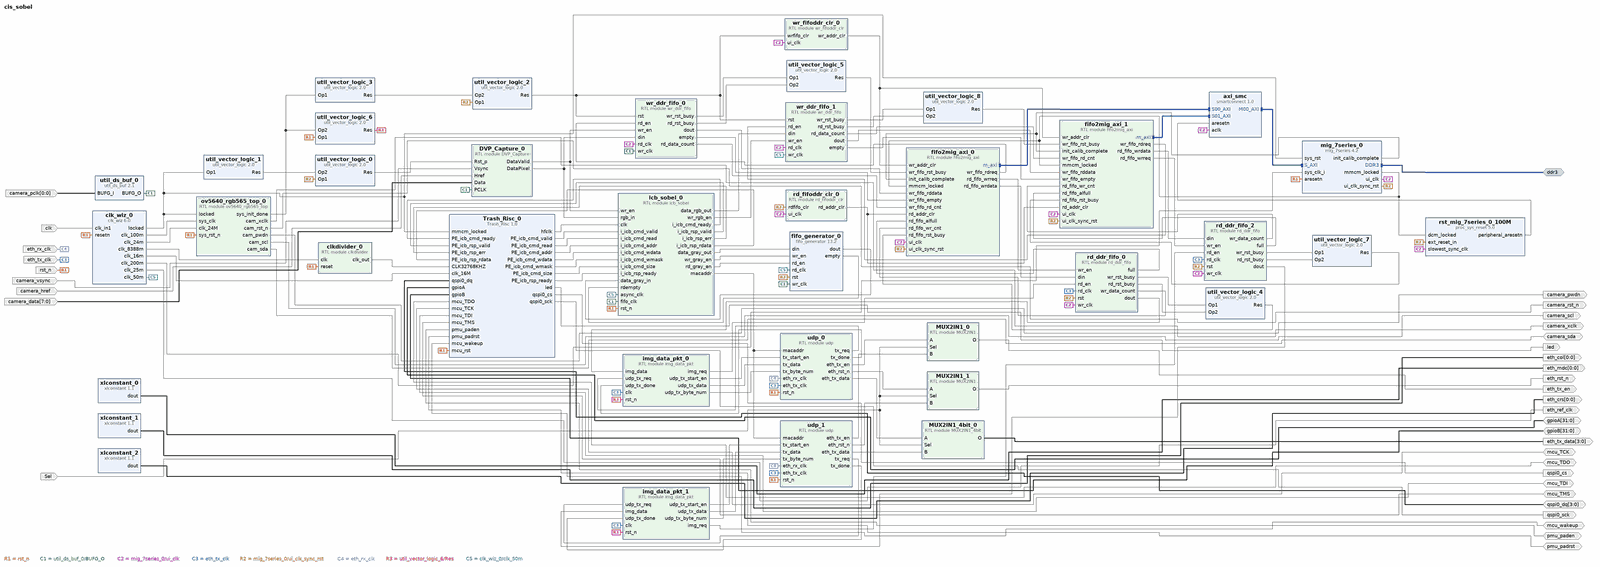
[diagram p0: block diagram of the top level, whole]
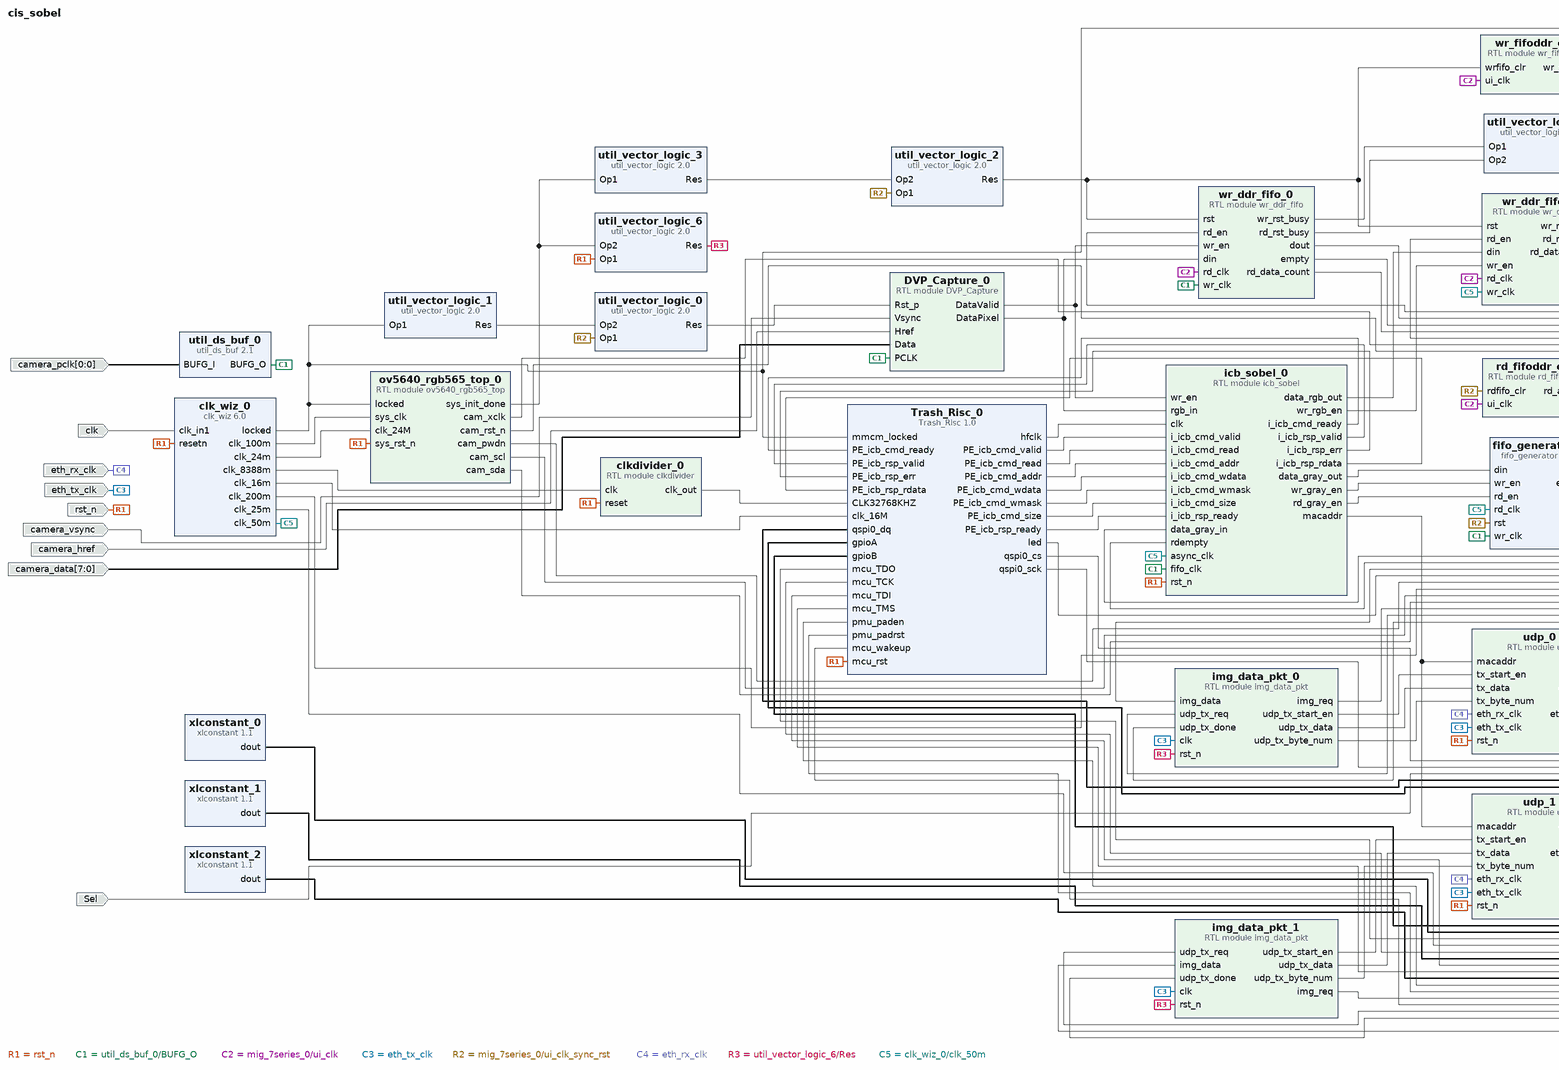
[diagram p1: block diagram of the top level, left part]
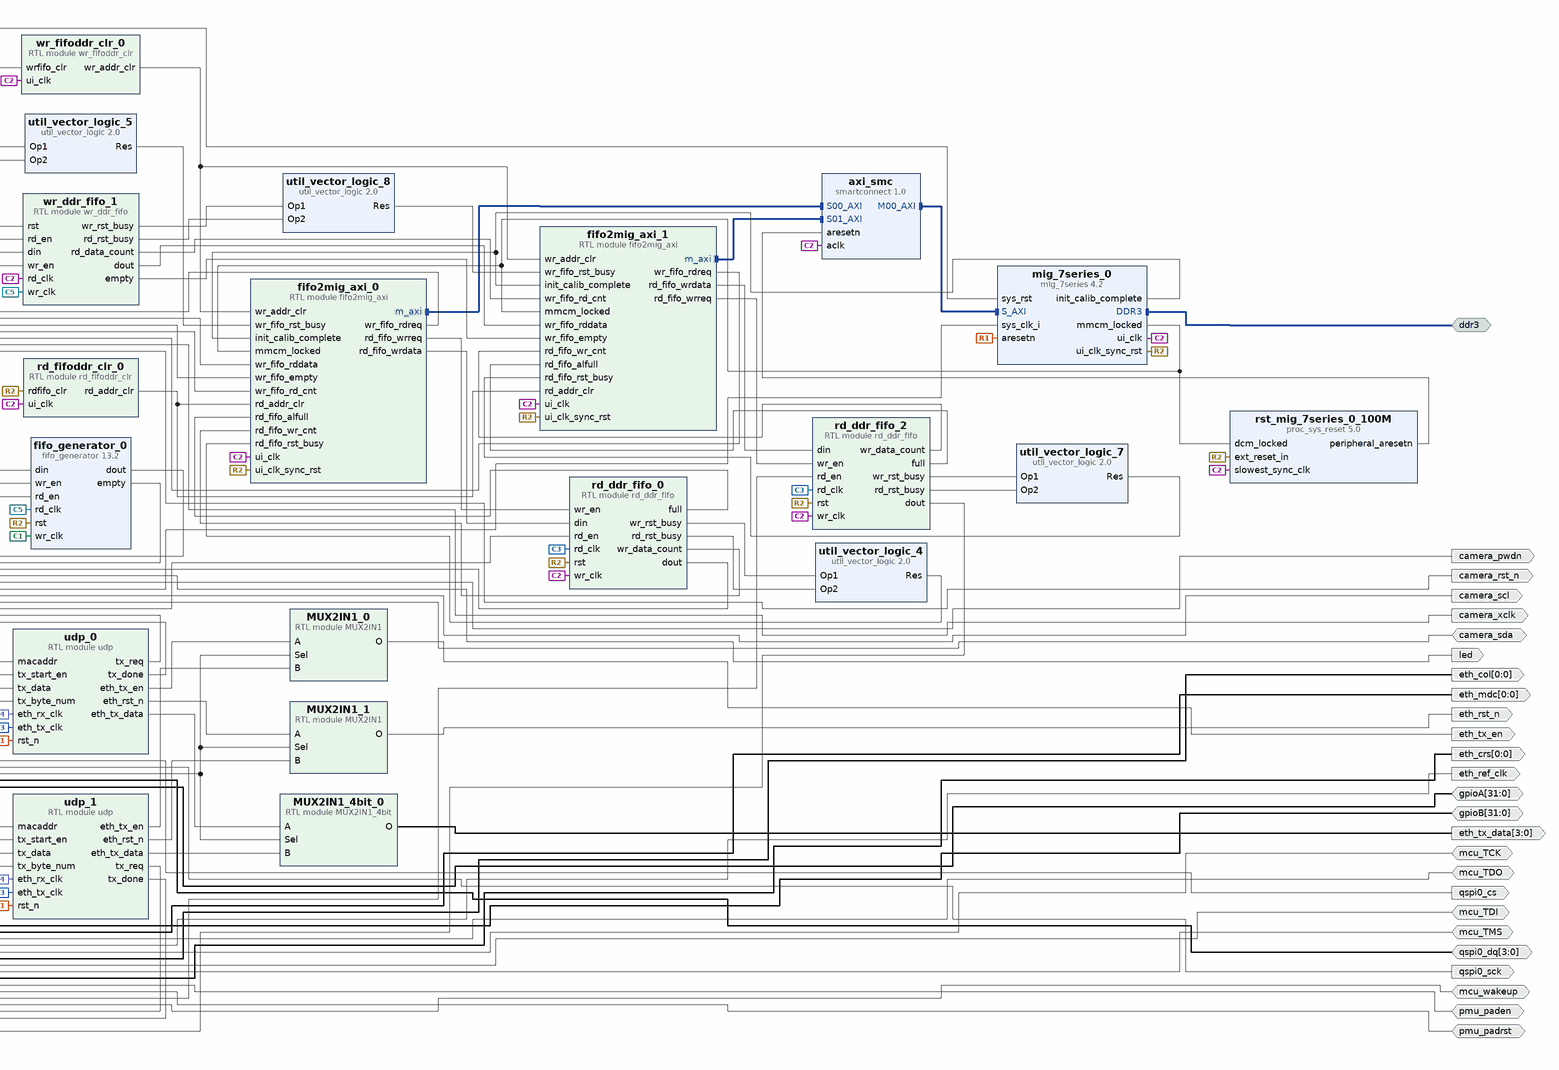
[diagram p2: block diagram of the top level, right part]
# Vivado block design cis_sobel, xc7a100tcsg324-1, Vivado 2019.1
create_bd_design cis_sobel

create_bd_intf_port -mode Master -vlnv xilinx.com:interface:ddrx_rtl:1.0 ddr3
create_bd_port -dir I -type rst rst_n
create_bd_port -dir O camera_xclk
create_bd_port -dir O -type rst camera_rst_n
create_bd_port -dir O camera_pwdn
create_bd_port -dir O camera_scl
create_bd_port -dir IO camera_sda
create_bd_port -dir I camera_vsync
create_bd_port -dir I camera_href
create_bd_port -dir I -from 7 -to 0 camera_data
create_bd_port -dir I -from 0 -to 0 -type clk camera_pclk
set_property -dict {CONFIG.FREQ_HZ 100000000} [get_bd_ports camera_pclk]
create_bd_port -dir I -type clk eth_tx_clk
set_property -dict {CONFIG.FREQ_HZ 100000000} [get_bd_ports eth_tx_clk]
create_bd_port -dir I -type clk clk
set_property -dict {CONFIG.FREQ_HZ 100000000} [get_bd_ports clk]
create_bd_port -dir I -type clk eth_rx_clk
set_property -dict {CONFIG.FREQ_HZ 100000000} [get_bd_ports eth_rx_clk]
create_bd_port -dir O -from 0 -to 0 eth_mdc
create_bd_port -dir O -from 0 -to 0 eth_col
create_bd_port -dir O -from 0 -to 0 eth_crs
create_bd_port -dir O -type clk eth_ref_clk
create_bd_port -dir O led
create_bd_port -dir O qspi0_cs
create_bd_port -dir O qspi0_sck
create_bd_port -dir IO -from 3 -to 0 qspi0_dq
create_bd_port -dir IO -from 31 -to 0 gpioA
create_bd_port -dir IO -from 31 -to 0 gpioB
create_bd_port -dir IO mcu_TDO
create_bd_port -dir IO mcu_TCK
create_bd_port -dir IO mcu_TDI
create_bd_port -dir IO mcu_TMS
create_bd_port -dir IO pmu_paden
create_bd_port -dir IO pmu_padrst
create_bd_port -dir IO mcu_wakeup
create_bd_port -dir O -from 3 -to 0 eth_tx_data
create_bd_port -dir I Sel
create_bd_port -dir O eth_tx_en
create_bd_port -dir O eth_rst_n

create_bd_cell -type module -reference fifo2mig_axi fifo2mig_axi_0
set_property -dict [list \
  CONFIG.AXI_ID {"0001"} \
  CONFIG.AXI_LEN {"00011111"} \
  CONFIG.RD_DDR_ADDR_BEGIN 614400 \
  CONFIG.RD_DDR_ADDR_END 1228800 \
  CONFIG.WR_DDR_ADDR_BEGIN 614400 \
  CONFIG.WR_DDR_ADDR_END 1228800 \
] [get_bd_cells fifo2mig_axi_0]
create_bd_cell -type module -reference img_data_pkt img_data_pkt_0
set_property -dict {CONFIG.CMOS_H_PIXEL {"01010000000"} CONFIG.CMOS_V_PIXEL {"00111100000"}} [get_bd_cells img_data_pkt_0]
create_bd_cell -type module -reference ov5640_rgb565_top ov5640_rgb565_top_0
create_bd_cell -type module -reference wr_ddr_fifo wr_ddr_fifo_0
create_bd_cell -type module -reference rd_ddr_fifo rd_ddr_fifo_0
create_bd_cell -type ip -vlnv xilinx.com:ip:mig_7series:4.2 mig_7series_0
set_property -dict [list \
  CONFIG.BOARD_MIG_PARAM Custom \
  CONFIG.MIG_DONT_TOUCH_PARAM Custom \
  CONFIG.RESET_BOARD_INTERFACE Custom \
  CONFIG.XML_INPUT_FILE mig_a.prj \
] [get_bd_cells mig_7series_0]
create_bd_cell -type ip -vlnv xilinx.com:ip:clk_wiz:6.0 clk_wiz_0
set_property -dict [list \
  CONFIG.CLKOUT1_JITTER 130.958 \
  CONFIG.CLKOUT1_PHASE_ERROR 98.575 \
  CONFIG.CLKOUT2_JITTER 175.402 \
  CONFIG.CLKOUT2_PHASE_ERROR 98.575 \
  CONFIG.CLKOUT2_REQUESTED_OUT_FREQ 25.000 \
  CONFIG.CLKOUT2_USED true \
  CONFIG.CLKOUT3_JITTER 177.091 \
  CONFIG.CLKOUT3_PHASE_ERROR 98.575 \
  CONFIG.CLKOUT3_REQUESTED_OUT_FREQ 24.000 \
  CONFIG.CLKOUT3_USED true \
  CONFIG.CLKOUT4_JITTER 114.829 \
  CONFIG.CLKOUT4_PHASE_ERROR 98.575 \
  CONFIG.CLKOUT4_REQUESTED_OUT_FREQ 200.000 \
  CONFIG.CLKOUT4_USED true \
  CONFIG.CLKOUT5_JITTER 191.683 \
  CONFIG.CLKOUT5_PHASE_ERROR 98.575 \
  CONFIG.CLKOUT5_REQUESTED_OUT_FREQ 16.000 \
  CONFIG.CLKOUT5_USED true \
  CONFIG.CLKOUT6_JITTER 216.703 \
  CONFIG.CLKOUT6_PHASE_ERROR 98.575 \
  CONFIG.CLKOUT6_REQUESTED_OUT_FREQ 8.388 \
  CONFIG.CLKOUT6_USED true \
  CONFIG.CLKOUT7_JITTER 151.636 \
  CONFIG.CLKOUT7_PHASE_ERROR 98.575 \
  CONFIG.CLKOUT7_REQUESTED_OUT_FREQ 50.000 \
  CONFIG.CLKOUT7_USED true \
  CONFIG.CLK_OUT1_PORT clk_100m \
  CONFIG.CLK_OUT2_PORT clk_25m \
  CONFIG.CLK_OUT3_PORT clk_24m \
  CONFIG.CLK_OUT4_PORT clk_200m \
  CONFIG.CLK_OUT5_PORT clk_16m \
  CONFIG.CLK_OUT6_PORT clk_8388m \
  CONFIG.CLK_OUT7_PORT clk_50m \
  CONFIG.MMCM_CLKFBOUT_MULT_F 10.000 \
  CONFIG.MMCM_CLKIN1_PERIOD 10.000 \
  CONFIG.MMCM_CLKIN2_PERIOD 10.000 \
  CONFIG.MMCM_CLKOUT0_DIVIDE_F 10.000 \
  CONFIG.MMCM_CLKOUT1_DIVIDE 40 \
  CONFIG.MMCM_CLKOUT2_DIVIDE 42 \
  CONFIG.MMCM_CLKOUT3_DIVIDE 5 \
  CONFIG.MMCM_CLKOUT4_DIVIDE 63 \
  CONFIG.MMCM_CLKOUT5_DIVIDE 119 \
  CONFIG.MMCM_CLKOUT6_DIVIDE 20 \
  CONFIG.NUM_OUT_CLKS 7 \
  CONFIG.RESET_PORT resetn \
  CONFIG.RESET_TYPE ACTIVE_LOW \
] [get_bd_cells clk_wiz_0]
create_bd_cell -type ip -vlnv xilinx.com:ip:util_ds_buf:2.1 util_ds_buf_0
set_property -dict {CONFIG.C_BUF_TYPE BUFG} [get_bd_cells util_ds_buf_0]
create_bd_cell -type module -reference DVP_Capture DVP_Capture_0
create_bd_cell -type ip -vlnv xilinx.com:ip:util_vector_logic:2.0 util_vector_logic_0
set_property -dict {CONFIG.C_OPERATION or CONFIG.C_SIZE 1} [get_bd_cells util_vector_logic_0]
create_bd_cell -type ip -vlnv xilinx.com:ip:util_vector_logic:2.0 util_vector_logic_1
set_property -dict {CONFIG.C_OPERATION not CONFIG.C_SIZE 1} [get_bd_cells util_vector_logic_1]
create_bd_cell -type ip -vlnv xilinx.com:ip:util_vector_logic:2.0 util_vector_logic_2
set_property -dict {CONFIG.C_OPERATION or CONFIG.C_SIZE 1} [get_bd_cells util_vector_logic_2]
create_bd_cell -type ip -vlnv xilinx.com:ip:util_vector_logic:2.0 util_vector_logic_3
set_property -dict {CONFIG.C_OPERATION not CONFIG.C_SIZE 1} [get_bd_cells util_vector_logic_3]
create_bd_cell -type ip -vlnv xilinx.com:ip:util_vector_logic:2.0 util_vector_logic_4
set_property -dict {CONFIG.C_OPERATION or CONFIG.C_SIZE 1} [get_bd_cells util_vector_logic_4]
create_bd_cell -type ip -vlnv xilinx.com:ip:util_vector_logic:2.0 util_vector_logic_5
set_property -dict {CONFIG.C_OPERATION or CONFIG.C_SIZE 1} [get_bd_cells util_vector_logic_5]
create_bd_cell -type ip -vlnv xilinx.com:ip:util_vector_logic:2.0 util_vector_logic_6
set_property -dict {CONFIG.C_OPERATION and CONFIG.C_SIZE 1} [get_bd_cells util_vector_logic_6]
create_bd_cell -type module -reference wr_fifoddr_clr wr_fifoddr_clr_0
create_bd_cell -type module -reference rd_fifoddr_clr rd_fifoddr_clr_0
create_bd_cell -type ip -vlnv xilinx.com:ip:xlconstant:1.1 xlconstant_0
create_bd_cell -type ip -vlnv xilinx.com:ip:xlconstant:1.1 xlconstant_1
create_bd_cell -type ip -vlnv xilinx.com:ip:xlconstant:1.1 xlconstant_2
set_property -dict {CONFIG.CONST_VAL 0} [get_bd_cells xlconstant_2]
create_bd_cell -type ip -vlnv xilinx.com:ip:smartconnect:1.0 axi_smc
set_property -dict {CONFIG.NUM_SI 2} [get_bd_cells axi_smc]
create_bd_cell -type ip -vlnv xilinx.com:ip:proc_sys_reset:5.0 rst_mig_7series_0_100M
create_bd_cell -type module -reference fifo2mig_axi fifo2mig_axi_1
set_property -dict [list \
  CONFIG.AXI_ID {"0000"} \
  CONFIG.AXI_LEN {"00011111"} \
  CONFIG.RD_DDR_ADDR_BEGIN 0 \
  CONFIG.RD_DDR_ADDR_END 614400 \
  CONFIG.WR_DDR_ADDR_BEGIN 0 \
  CONFIG.WR_DDR_ADDR_END 614400 \
] [get_bd_cells fifo2mig_axi_1]
create_bd_cell -type module -reference clkdivider clkdivider_0
create_bd_cell -type module -reference wr_ddr_fifo wr_ddr_fifo_1
create_bd_cell -type module -reference rd_ddr_fifo rd_ddr_fifo_2
create_bd_cell -type ip -vlnv xilinx.com:ip:util_vector_logic:2.0 util_vector_logic_7
set_property -dict {CONFIG.C_OPERATION or CONFIG.C_SIZE 1} [get_bd_cells util_vector_logic_7]
create_bd_cell -type ip -vlnv xilinx.com:ip:util_vector_logic:2.0 util_vector_logic_8
set_property -dict {CONFIG.C_OPERATION or CONFIG.C_SIZE 1} [get_bd_cells util_vector_logic_8]
create_bd_cell -type module -reference img_data_pkt img_data_pkt_1
set_property -dict {CONFIG.CMOS_H_PIXEL {"01010000000"} CONFIG.CMOS_V_PIXEL {"00111100000"}} [get_bd_cells img_data_pkt_1]
create_bd_cell -type module -reference MUX2IN1 MUX2IN1_0
create_bd_cell -type module -reference MUX2IN1 MUX2IN1_1
create_bd_cell -type module -reference MUX2IN1_4bit MUX2IN1_4bit_0
create_bd_cell -type ip -vlnv xilinx.com:ip:fifo_generator:13.2 fifo_generator_0
set_property -dict [list \
  CONFIG.Enable_Safety_Circuit true \
  CONFIG.Fifo_Implementation Independent_Clocks_Block_RAM \
  CONFIG.Full_Flags_Reset_Value 1 \
  CONFIG.Input_Data_Width 8 \
  CONFIG.Output_Data_Width 8 \
] [get_bd_cells fifo_generator_0]
create_bd_cell -type ip -vlnv xilinx.com:user:Trash_Risc:1.0 Trash_Risc_0
create_bd_cell -type module -reference udp udp_0
set_property -dict {CONFIG.BOARD_IP 0xc0a80002 CONFIG.DES_IP 0xc0a80003 CONFIG.DES_MAC 0x70B5E849A3D2} [get_bd_cells udp_0]
create_bd_cell -type module -reference udp udp_1
set_property -dict {CONFIG.BOARD_IP 0xc0a80002 CONFIG.DES_IP 0xc0a80003 CONFIG.DES_MAC 0x70B5E849A3D2} [get_bd_cells udp_1]
create_bd_cell -type module -reference icb_sobel icb_sobel_0

# ---- connections ----

connect_bd_intf_net [get_bd_intf_pins fifo2mig_axi_0/m_axi] [get_bd_intf_pins axi_smc/S00_AXI]
connect_bd_intf_net [get_bd_intf_pins fifo2mig_axi_1/m_axi] [get_bd_intf_pins axi_smc/S01_AXI]
connect_bd_intf_net [get_bd_intf_pins axi_smc/M00_AXI] [get_bd_intf_pins mig_7series_0/S_AXI]
connect_bd_intf_net [get_bd_intf_ports ddr3] [get_bd_intf_pins mig_7series_0/DDR3]
connect_bd_net [get_bd_pins wr_ddr_fifo_0/dout] [get_bd_pins fifo2mig_axi_0/wr_fifo_rddata]
connect_bd_net [get_bd_pins clk_wiz_0/clk_100m] [get_bd_pins ov5640_rgb565_top_0/sys_clk]
connect_bd_net [get_bd_ports rst_n] \
  [get_bd_pins ov5640_rgb565_top_0/sys_rst_n] [get_bd_pins clk_wiz_0/resetn] [get_bd_pins mig_7series_0/aresetn] \
  [get_bd_pins util_vector_logic_6/Op1] [get_bd_pins clkdivider_0/reset] [get_bd_pins Trash_Risc_0/mcu_rst] \
  [get_bd_pins udp_0/rst_n] [get_bd_pins udp_1/rst_n] [get_bd_pins icb_sobel_0/rst_n]
connect_bd_net [get_bd_pins clk_wiz_0/clk_24m] [get_bd_pins ov5640_rgb565_top_0/clk_24M]
connect_bd_net [get_bd_pins clk_wiz_0/locked] \
  [get_bd_pins ov5640_rgb565_top_0/locked] [get_bd_pins mig_7series_0/sys_rst] [get_bd_pins util_vector_logic_1/Op1] \
  [get_bd_pins Trash_Risc_0/mmcm_locked]
connect_bd_net [get_bd_pins ov5640_rgb565_top_0/cam_xclk] [get_bd_ports camera_xclk]
connect_bd_net [get_bd_pins ov5640_rgb565_top_0/cam_rst_n] [get_bd_ports camera_rst_n]
connect_bd_net [get_bd_pins ov5640_rgb565_top_0/cam_pwdn] [get_bd_ports camera_pwdn]
connect_bd_net [get_bd_pins ov5640_rgb565_top_0/cam_scl] [get_bd_ports camera_scl]
connect_bd_net [get_bd_ports camera_sda] [get_bd_pins ov5640_rgb565_top_0/cam_sda]
connect_bd_net [get_bd_pins util_ds_buf_0/BUFG_O] \
  [get_bd_pins DVP_Capture_0/PCLK] [get_bd_pins wr_ddr_fifo_0/wr_clk] [get_bd_pins fifo_generator_0/wr_clk] \
  [get_bd_pins icb_sobel_0/fifo_clk]
connect_bd_net [get_bd_ports camera_vsync] [get_bd_pins DVP_Capture_0/Vsync]
connect_bd_net [get_bd_ports camera_href] [get_bd_pins DVP_Capture_0/Href]
connect_bd_net [get_bd_ports camera_data] [get_bd_pins DVP_Capture_0/Data]
connect_bd_net [get_bd_ports camera_pclk] [get_bd_pins util_ds_buf_0/BUFG_I]
connect_bd_net [get_bd_pins DVP_Capture_0/DataValid] [get_bd_pins wr_ddr_fifo_0/wr_en] [get_bd_pins icb_sobel_0/wr_en]
connect_bd_net [get_bd_pins DVP_Capture_0/DataPixel] [get_bd_pins wr_ddr_fifo_0/din] [get_bd_pins icb_sobel_0/rgb_in]
connect_bd_net [get_bd_pins mig_7series_0/ui_clk] \
  [get_bd_pins wr_ddr_fifo_0/rd_clk] [get_bd_pins rd_ddr_fifo_0/wr_clk] [get_bd_pins fifo2mig_axi_0/ui_clk] \
  [get_bd_pins wr_fifoddr_clr_0/ui_clk] [get_bd_pins rd_fifoddr_clr_0/ui_clk] [get_bd_pins axi_smc/aclk] \
  [get_bd_pins rst_mig_7series_0_100M/slowest_sync_clk] [get_bd_pins fifo2mig_axi_1/ui_clk] \
  [get_bd_pins wr_ddr_fifo_1/rd_clk] [get_bd_pins rd_ddr_fifo_2/wr_clk]
connect_bd_net [get_bd_pins fifo2mig_axi_0/wr_fifo_rdreq] [get_bd_pins wr_ddr_fifo_0/rd_en]
connect_bd_net [get_bd_pins wr_ddr_fifo_0/empty] [get_bd_pins fifo2mig_axi_0/wr_fifo_empty]
connect_bd_net [get_bd_pins wr_ddr_fifo_0/rd_data_count] [get_bd_pins fifo2mig_axi_0/wr_fifo_rd_cnt]
connect_bd_net [get_bd_pins fifo2mig_axi_0/rd_fifo_wrreq] [get_bd_pins rd_ddr_fifo_0/wr_en]
connect_bd_net [get_bd_pins fifo2mig_axi_0/rd_fifo_wrdata] [get_bd_pins rd_ddr_fifo_0/din]
connect_bd_net [get_bd_pins rd_ddr_fifo_0/full] [get_bd_pins fifo2mig_axi_0/rd_fifo_alfull]
connect_bd_net [get_bd_pins rd_ddr_fifo_0/wr_data_count] [get_bd_pins fifo2mig_axi_0/rd_fifo_wr_cnt]
connect_bd_net [get_bd_ports eth_tx_clk] \
  [get_bd_pins rd_ddr_fifo_0/rd_clk] [get_bd_pins img_data_pkt_0/clk] [get_bd_pins rd_ddr_fifo_2/rd_clk] \
  [get_bd_pins img_data_pkt_1/clk] [get_bd_pins udp_0/eth_tx_clk] [get_bd_pins udp_1/eth_tx_clk]
connect_bd_net [get_bd_pins img_data_pkt_0/img_req] [get_bd_pins rd_ddr_fifo_0/rd_en]
connect_bd_net [get_bd_pins rd_ddr_fifo_0/dout] [get_bd_pins img_data_pkt_0/img_data]
connect_bd_net [get_bd_ports clk] [get_bd_pins clk_wiz_0/clk_in1]
connect_bd_net [get_bd_pins mig_7series_0/ui_clk_sync_rst] \
  [get_bd_pins fifo2mig_axi_0/ui_clk_sync_rst] [get_bd_pins util_vector_logic_0/Op1] [get_bd_pins rd_ddr_fifo_0/rst] \
  [get_bd_pins util_vector_logic_2/Op1] [get_bd_pins rd_fifoddr_clr_0/rdfifo_clr] \
  [get_bd_pins rst_mig_7series_0_100M/ext_reset_in] [get_bd_pins fifo2mig_axi_1/ui_clk_sync_rst] \
  [get_bd_pins rd_ddr_fifo_2/rst] [get_bd_pins fifo_generator_0/rst]
connect_bd_net [get_bd_pins mig_7series_0/init_calib_complete] \
  [get_bd_pins fifo2mig_axi_0/init_calib_complete] [get_bd_pins fifo2mig_axi_1/init_calib_complete]
connect_bd_net [get_bd_pins mig_7series_0/mmcm_locked] \
  [get_bd_pins fifo2mig_axi_0/mmcm_locked] [get_bd_pins rst_mig_7series_0_100M/dcm_locked] \
  [get_bd_pins fifo2mig_axi_1/mmcm_locked]
connect_bd_net [get_bd_pins clk_wiz_0/clk_200m] [get_bd_pins mig_7series_0/sys_clk_i]
connect_bd_net [get_bd_ports eth_rx_clk] [get_bd_pins udp_0/eth_rx_clk] [get_bd_pins udp_1/eth_rx_clk]
connect_bd_net [get_bd_pins util_vector_logic_0/Res] [get_bd_pins DVP_Capture_0/Rst_p]
connect_bd_net [get_bd_pins util_vector_logic_1/Res] [get_bd_pins util_vector_logic_0/Op2]
connect_bd_net [get_bd_pins util_vector_logic_3/Res] [get_bd_pins util_vector_logic_2/Op2]
connect_bd_net [get_bd_pins ov5640_rgb565_top_0/sys_init_done] [get_bd_pins util_vector_logic_3/Op1] [get_bd_pins util_vector_logic_6/Op2]
connect_bd_net [get_bd_pins util_vector_logic_2/Res] \
  [get_bd_pins wr_ddr_fifo_0/rst] [get_bd_pins wr_fifoddr_clr_0/wrfifo_clr] [get_bd_pins wr_ddr_fifo_1/rst]
connect_bd_net [get_bd_pins wr_ddr_fifo_0/wr_rst_busy] [get_bd_pins util_vector_logic_5/Op1]
connect_bd_net [get_bd_pins wr_ddr_fifo_0/rd_rst_busy] [get_bd_pins util_vector_logic_5/Op2]
connect_bd_net [get_bd_pins rd_ddr_fifo_0/wr_rst_busy] [get_bd_pins util_vector_logic_4/Op1]
connect_bd_net [get_bd_pins rd_ddr_fifo_0/rd_rst_busy] [get_bd_pins util_vector_logic_4/Op2]
connect_bd_net [get_bd_pins util_vector_logic_5/Res] [get_bd_pins fifo2mig_axi_0/wr_fifo_rst_busy]
connect_bd_net [get_bd_pins util_vector_logic_4/Res] [get_bd_pins fifo2mig_axi_0/rd_fifo_rst_busy]
connect_bd_net [get_bd_pins util_vector_logic_6/Res] [get_bd_pins img_data_pkt_0/rst_n] [get_bd_pins img_data_pkt_1/rst_n]
connect_bd_net [get_bd_pins wr_fifoddr_clr_0/wr_addr_clr] [get_bd_pins fifo2mig_axi_0/wr_addr_clr] [get_bd_pins fifo2mig_axi_1/wr_addr_clr]
connect_bd_net [get_bd_pins rd_fifoddr_clr_0/rd_addr_clr] [get_bd_pins fifo2mig_axi_0/rd_addr_clr] [get_bd_pins fifo2mig_axi_1/rd_addr_clr]
connect_bd_net [get_bd_pins xlconstant_0/dout] [get_bd_ports eth_mdc]
connect_bd_net [get_bd_pins xlconstant_1/dout] [get_bd_ports eth_col]
connect_bd_net [get_bd_pins xlconstant_2/dout] [get_bd_ports eth_crs]
connect_bd_net [get_bd_pins clk_wiz_0/clk_25m] [get_bd_ports eth_ref_clk]
connect_bd_net [get_bd_pins rst_mig_7series_0_100M/peripheral_aresetn] [get_bd_pins axi_smc/aresetn]
connect_bd_net [get_bd_pins clk_wiz_0/clk_16m] [get_bd_pins Trash_Risc_0/clk_16M]
connect_bd_net [get_bd_pins clkdivider_0/clk_out] [get_bd_pins Trash_Risc_0/CLK32768KHZ]
connect_bd_net [get_bd_pins clk_wiz_0/clk_8388m] [get_bd_pins clkdivider_0/clk]
connect_bd_net [get_bd_pins Trash_Risc_0/led] [get_bd_ports led]
connect_bd_net [get_bd_pins Trash_Risc_0/qspi0_cs] [get_bd_ports qspi0_cs]
connect_bd_net [get_bd_pins Trash_Risc_0/qspi0_sck] [get_bd_ports qspi0_sck]
connect_bd_net [get_bd_ports qspi0_dq] [get_bd_pins Trash_Risc_0/qspi0_dq]
connect_bd_net [get_bd_ports gpioA] [get_bd_pins Trash_Risc_0/gpioA]
connect_bd_net [get_bd_ports gpioB] [get_bd_pins Trash_Risc_0/gpioB]
connect_bd_net [get_bd_ports mcu_TDO] [get_bd_pins Trash_Risc_0/mcu_TDO]
connect_bd_net [get_bd_ports mcu_TCK] [get_bd_pins Trash_Risc_0/mcu_TCK]
connect_bd_net [get_bd_ports mcu_TDI] [get_bd_pins Trash_Risc_0/mcu_TDI]
connect_bd_net [get_bd_ports mcu_TMS] [get_bd_pins Trash_Risc_0/mcu_TMS]
connect_bd_net [get_bd_ports pmu_paden] [get_bd_pins Trash_Risc_0/pmu_paden]
connect_bd_net [get_bd_ports pmu_padrst] [get_bd_pins Trash_Risc_0/pmu_padrst]
connect_bd_net [get_bd_ports mcu_wakeup] [get_bd_pins Trash_Risc_0/mcu_wakeup]
connect_bd_net [get_bd_pins wr_ddr_fifo_1/rd_data_count] [get_bd_pins fifo2mig_axi_1/wr_fifo_rd_cnt]
connect_bd_net [get_bd_pins wr_ddr_fifo_1/dout] [get_bd_pins fifo2mig_axi_1/wr_fifo_rddata]
connect_bd_net [get_bd_pins rd_ddr_fifo_2/wr_data_count] [get_bd_pins fifo2mig_axi_1/rd_fifo_wr_cnt]
connect_bd_net [get_bd_pins fifo2mig_axi_1/rd_fifo_wrdata] [get_bd_pins rd_ddr_fifo_2/din]
connect_bd_net [get_bd_pins wr_ddr_fifo_1/wr_rst_busy] [get_bd_pins util_vector_logic_8/Op1]
connect_bd_net [get_bd_pins wr_ddr_fifo_1/rd_rst_busy] [get_bd_pins util_vector_logic_8/Op2]
connect_bd_net [get_bd_pins util_vector_logic_8/Res] [get_bd_pins fifo2mig_axi_1/wr_fifo_rst_busy]
connect_bd_net [get_bd_pins rd_ddr_fifo_2/wr_rst_busy] [get_bd_pins util_vector_logic_7/Op1]
connect_bd_net [get_bd_pins rd_ddr_fifo_2/rd_rst_busy] [get_bd_pins util_vector_logic_7/Op2]
connect_bd_net [get_bd_pins util_vector_logic_7/Res] [get_bd_pins fifo2mig_axi_1/rd_fifo_rst_busy]
connect_bd_net [get_bd_pins wr_ddr_fifo_1/empty] [get_bd_pins fifo2mig_axi_1/wr_fifo_empty]
connect_bd_net [get_bd_pins rd_ddr_fifo_2/full] [get_bd_pins fifo2mig_axi_1/rd_fifo_alfull]
connect_bd_net [get_bd_pins fifo2mig_axi_1/wr_fifo_rdreq] [get_bd_pins wr_ddr_fifo_1/rd_en]
connect_bd_net [get_bd_pins fifo2mig_axi_1/rd_fifo_wrreq] [get_bd_pins rd_ddr_fifo_2/wr_en]
connect_bd_net [get_bd_pins img_data_pkt_1/img_req] [get_bd_pins rd_ddr_fifo_2/rd_en]
connect_bd_net [get_bd_pins rd_ddr_fifo_2/dout] [get_bd_pins img_data_pkt_1/img_data]
connect_bd_net [get_bd_pins udp_0/tx_req] [get_bd_pins img_data_pkt_0/udp_tx_req]
connect_bd_net [get_bd_pins udp_0/tx_done] [get_bd_pins img_data_pkt_0/udp_tx_done]
connect_bd_net [get_bd_pins img_data_pkt_0/udp_tx_start_en] [get_bd_pins udp_0/tx_start_en]
connect_bd_net [get_bd_pins img_data_pkt_0/udp_tx_data] [get_bd_pins udp_0/tx_data]
connect_bd_net [get_bd_pins img_data_pkt_0/udp_tx_byte_num] [get_bd_pins udp_0/tx_byte_num]
connect_bd_net [get_bd_pins img_data_pkt_1/udp_tx_start_en] [get_bd_pins udp_1/tx_start_en]
connect_bd_net [get_bd_pins img_data_pkt_1/udp_tx_data] [get_bd_pins udp_1/tx_data]
connect_bd_net [get_bd_pins img_data_pkt_1/udp_tx_byte_num] [get_bd_pins udp_1/tx_byte_num]
connect_bd_net [get_bd_pins udp_1/tx_req] [get_bd_pins img_data_pkt_1/udp_tx_req]
connect_bd_net [get_bd_pins udp_1/tx_done] [get_bd_pins img_data_pkt_1/udp_tx_done]
connect_bd_net [get_bd_pins udp_0/eth_tx_en] [get_bd_pins MUX2IN1_0/A]
connect_bd_net [get_bd_pins udp_1/eth_tx_en] [get_bd_pins MUX2IN1_0/B]
connect_bd_net [get_bd_ports Sel] [get_bd_pins MUX2IN1_0/Sel] [get_bd_pins MUX2IN1_1/Sel] [get_bd_pins MUX2IN1_4bit_0/Sel]
connect_bd_net [get_bd_pins MUX2IN1_0/O] [get_bd_ports eth_tx_en]
connect_bd_net [get_bd_pins udp_1/eth_rst_n] [get_bd_pins MUX2IN1_1/B]
connect_bd_net [get_bd_pins udp_0/eth_rst_n] [get_bd_pins MUX2IN1_1/A]
connect_bd_net [get_bd_pins MUX2IN1_1/O] [get_bd_ports eth_rst_n]
connect_bd_net [get_bd_pins MUX2IN1_4bit_0/O] [get_bd_ports eth_tx_data]
connect_bd_net [get_bd_pins udp_1/eth_tx_data] [get_bd_pins MUX2IN1_4bit_0/B]
connect_bd_net [get_bd_pins udp_0/eth_tx_data] [get_bd_pins MUX2IN1_4bit_0/A]
connect_bd_net [get_bd_pins Trash_Risc_0/hfclk] [get_bd_pins icb_sobel_0/clk]
connect_bd_net [get_bd_pins icb_sobel_0/data_gray_out] [get_bd_pins fifo_generator_0/din]
connect_bd_net [get_bd_pins icb_sobel_0/wr_gray_en] [get_bd_pins fifo_generator_0/wr_en]
connect_bd_net [get_bd_pins fifo_generator_0/dout] [get_bd_pins icb_sobel_0/data_gray_in]
connect_bd_net [get_bd_pins fifo_generator_0/empty] [get_bd_pins icb_sobel_0/rdempty]
connect_bd_net [get_bd_pins icb_sobel_0/rd_gray_en] [get_bd_pins fifo_generator_0/rd_en]
connect_bd_net [get_bd_pins icb_sobel_0/data_rgb_out] [get_bd_pins wr_ddr_fifo_1/din]
connect_bd_net [get_bd_pins icb_sobel_0/wr_rgb_en] [get_bd_pins wr_ddr_fifo_1/wr_en]
connect_bd_net [get_bd_pins clk_wiz_0/clk_50m] \
  [get_bd_pins wr_ddr_fifo_1/wr_clk] [get_bd_pins fifo_generator_0/rd_clk] [get_bd_pins icb_sobel_0/async_clk]
connect_bd_net [get_bd_pins Trash_Risc_0/PE_icb_cmd_valid] [get_bd_pins icb_sobel_0/i_icb_cmd_valid]
connect_bd_net [get_bd_pins Trash_Risc_0/PE_icb_cmd_read] [get_bd_pins icb_sobel_0/i_icb_cmd_read]
connect_bd_net [get_bd_pins Trash_Risc_0/PE_icb_cmd_addr] [get_bd_pins icb_sobel_0/i_icb_cmd_addr]
connect_bd_net [get_bd_pins Trash_Risc_0/PE_icb_cmd_wdata] [get_bd_pins icb_sobel_0/i_icb_cmd_wdata]
connect_bd_net [get_bd_pins Trash_Risc_0/PE_icb_cmd_wmask] [get_bd_pins icb_sobel_0/i_icb_cmd_wmask]
connect_bd_net [get_bd_pins Trash_Risc_0/PE_icb_cmd_size] [get_bd_pins icb_sobel_0/i_icb_cmd_size]
connect_bd_net [get_bd_pins Trash_Risc_0/PE_icb_rsp_ready] [get_bd_pins icb_sobel_0/i_icb_rsp_ready]
connect_bd_net [get_bd_pins icb_sobel_0/i_icb_cmd_ready] [get_bd_pins Trash_Risc_0/PE_icb_cmd_ready]
connect_bd_net [get_bd_pins icb_sobel_0/i_icb_rsp_valid] [get_bd_pins Trash_Risc_0/PE_icb_rsp_valid]
connect_bd_net [get_bd_pins icb_sobel_0/i_icb_rsp_err] [get_bd_pins Trash_Risc_0/PE_icb_rsp_err]
connect_bd_net [get_bd_pins icb_sobel_0/i_icb_rsp_rdata] [get_bd_pins Trash_Risc_0/PE_icb_rsp_rdata]
connect_bd_net [get_bd_pins icb_sobel_0/macaddr] [get_bd_pins udp_0/macaddr] [get_bd_pins udp_1/macaddr]

# ---- address map ----
assign_bd_address -offset 0x0000000 -range 128M -target_address_space [get_bd_addr_spaces fifo2mig_axi_0/m_axi] [get_bd_addr_segs mig_7series_0/memmap/memaddr]
assign_bd_address -offset 0x0000000 -range 128M -target_address_space [get_bd_addr_spaces fifo2mig_axi_1/m_axi] [get_bd_addr_segs mig_7series_0/memmap/memaddr]

validate_bd_design
save_bd_design
